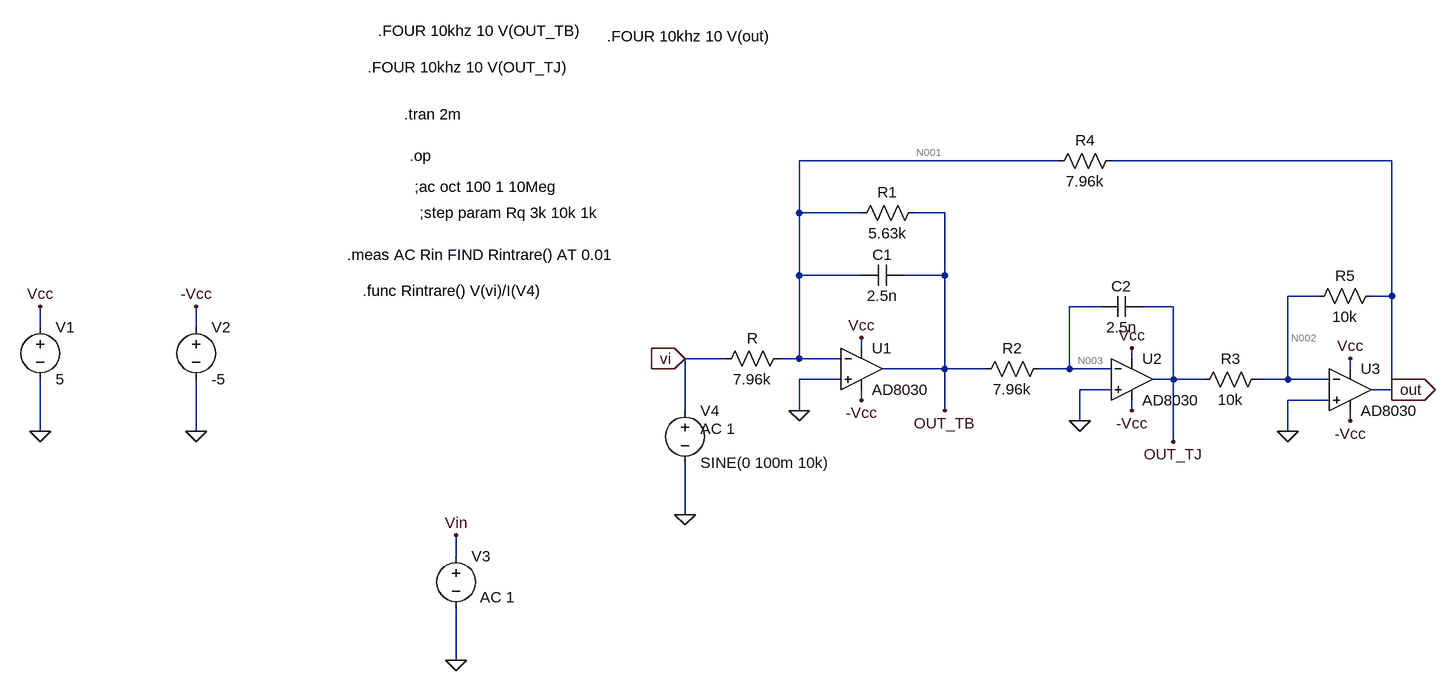
[diagram p0: schematic etaj2_.asc]
etaj2_.asc, the LTspice schematic file:
Version 4
SHEET 1 880 712
WIRE 208 -528 -192 -528
WIRE 720 -528 288 -528
WIRE -192 -448 -192 -528
WIRE -96 -448 -192 -448
WIRE 32 -448 -16 -448
WIRE -192 -352 -192 -448
WIRE -96 -352 -192 -352
WIRE 32 -352 32 -448
WIRE 32 -352 -32 -352
WIRE 608 -320 560 -320
WIRE 720 -320 720 -528
WIRE 720 -320 688 -320
WIRE 272 -304 224 -304
WIRE 384 -304 336 -304
WIRE -1360 -272 -1360 -304
WIRE -1120 -272 -1120 -304
WIRE -96 -240 -96 -256
WIRE -304 -224 -368 -224
WIRE -192 -224 -192 -352
WIRE -192 -224 -224 -224
WIRE -128 -224 -192 -224
WIRE 320 -224 320 -240
WIRE 32 -208 32 -352
WIRE 32 -208 -64 -208
WIRE 96 -208 32 -208
WIRE 224 -208 224 -304
WIRE 224 -208 176 -208
WIRE 288 -208 224 -208
WIRE 656 -208 656 -224
WIRE -128 -192 -192 -192
WIRE 384 -192 384 -304
WIRE 384 -192 352 -192
WIRE 432 -192 384 -192
WIRE 560 -192 560 -320
WIRE 560 -192 512 -192
WIRE 624 -192 560 -192
WIRE 288 -176 240 -176
WIRE 720 -176 720 -320
WIRE 720 -176 688 -176
WIRE -96 -160 -96 -176
WIRE 624 -160 560 -160
WIRE -368 -144 -368 -224
WIRE -192 -144 -192 -192
WIRE 32 -144 32 -208
WIRE 320 -144 320 -160
WIRE 240 -128 240 -176
WIRE 656 -128 656 -144
WIRE -1360 -112 -1360 -192
WIRE -1120 -112 -1120 -192
WIRE 560 -112 560 -160
WIRE 384 -96 384 -192
WIRE -368 16 -368 -64
WIRE -720 80 -720 48
WIRE -720 240 -720 160
FLAG -192 -144 0
FLAG 240 -128 0
FLAG 560 -112 0
FLAG -96 -256 Vcc
FLAG 320 -240 Vcc
FLAG 656 -224 Vcc
FLAG -96 -160 -Vcc
FLAG 320 -144 -Vcc
FLAG 656 -128 -Vcc
FLAG -720 48 Vin
FLAG 32 -144 OUT_TB
FLAG 384 -96 OUT_TJ
FLAG -1360 -304 Vcc
FLAG -1120 -304 -Vcc
FLAG -1360 -112 0
FLAG -1120 -112 0
FLAG 720 -176 out
IOPIN 720 -176 Out
FLAG -720 240 0
FLAG -368 16 0
FLAG -368 -224 vi
IOPIN -368 -224 In
SYMBOL OpAmps\\AD8030 -96 -272 R0
SYMATTR InstName U1
SYMBOL OpAmps\\AD8030 320 -256 R0
SYMATTR InstName U2
SYMBOL OpAmps\\AD8030 656 -240 R0
SYMATTR InstName U3
SYMBOL res -208 -240 R90
WINDOW 0 0 56 VBottom 2
WINDOW 3 32 56 VTop 2
SYMATTR InstName R
SYMATTR Value 7.96k
SYMBOL res 192 -224 R90
WINDOW 0 0 56 VBottom 2
WINDOW 3 32 56 VTop 2
SYMATTR InstName R2
SYMATTR Value 7.96k
SYMBOL res 528 -208 R90
WINDOW 0 0 56 VBottom 2
WINDOW 3 32 56 VTop 2
SYMATTR InstName R3
SYMATTR Value 10k
SYMBOL res 304 -544 R90
WINDOW 0 0 56 VBottom 2
WINDOW 3 32 56 VTop 2
SYMATTR InstName R4
SYMATTR Value 7.96k
SYMBOL res 0 -464 R90
WINDOW 0 0 56 VBottom 2
WINDOW 3 32 56 VTop 2
SYMATTR InstName R1
SYMATTR Value 5.63k
SYMBOL cap -96 -336 R270
WINDOW 0 32 32 VTop 2
WINDOW 3 0 32 VBottom 2
SYMATTR InstName C1
SYMATTR Value 2.5n
SYMBOL cap 272 -288 R270
WINDOW 0 32 32 VTop 2
WINDOW 3 0 32 VBottom 2
SYMATTR InstName C2
SYMATTR Value 2.5n
SYMBOL res 704 -336 R90
WINDOW 0 0 56 VBottom 2
WINDOW 3 32 56 VTop 2
SYMATTR InstName R5
SYMATTR Value 10k
SYMBOL voltage -1360 -288 R0
SYMATTR InstName V1
SYMATTR Value 5
SYMBOL voltage -1120 -288 R0
SYMATTR InstName V2
SYMATTR Value -5
SYMBOL voltage -720 64 R0
WINDOW 123 37 79 Left 2
WINDOW 39 0 0 Left 0
SYMATTR Value2 AC 1
SYMATTR InstName V3
SYMATTR Value ""
SYMBOL voltage -368 -160 R0
WINDOW 123 24 44 Left 2
WINDOW 39 0 0 Left 0
SYMATTR Value2 AC 1
SYMATTR InstName V4
SYMATTR Value SINE(0 100m 10k)
TEXT -792 -536 Left 2 !.op
TEXT -784 -488 Left 2 !;ac oct 100 1 10Meg
TEXT -776 -448 Left 2 !;step param Rq 3k 10k 1k
TEXT -800 -600 Left 2 !.tran 2m
TEXT -856 -672 Left 2 !.FOUR 10khz 10 V(OUT_TJ)
TEXT -840 -728 Left 2 !.FOUR 10khz 10 V(OUT_TB)
TEXT -488 -720 Left 2 !.FOUR 10khz 10 V(out)
TEXT -888 -384 Left 2 !.meas AC Rin FIND Rintrare() AT 0.01
TEXT -864 -328 Left 2 !.func Rintrare() V(vi)/I(V4)

The netlist it stands for:
* etaj2_.asc
XU1 0 N001 Vcc -Vcc OUT_TB AD8040  ; AD8030, pins In+ In- V+ V- OUT
XU2 0 N003 Vcc -Vcc OUT_TJ AD8040  ; AD8030, pins In+ In- V+ V- OUT
XU3 0 N002 Vcc -Vcc out AD8040  ; AD8030, pins In+ In- V+ V- OUT
R N001 vi 7.96k
R2 N003 OUT_TB 7.96k
R3 N002 OUT_TJ 10k
R4 out N001 7.96k
R1 OUT_TB N001 5.63k
C1 N001 OUT_TB 2.5n
C2 N003 OUT_TJ 2.5n
R5 out N002 10k
V1 Vcc 0 5
V2 -Vcc 0 -5
V3 Vin 0 AC 1
V4 vi 0 SINE(0 100m 10k) AC 1
.op
;ac oct 100 1 10Meg
;step param Rq 3k 10k 1k
.tran 2m
.FOUR 10khz 10 V(OUT_TJ)
.FOUR 10khz 10 V(OUT_TB)
.FOUR 10khz 10 V(out)
.meas AC Rin FIND Rintrare() AT 0.01
.func Rintrare() V(vi)/I(V4)
.lib ADI.lib
.backanno
.end

* Results of the author's LTspice run, read from the files saved beside the schematic
* Operating Point, zero values left out:
*   V(vcc) = 5 V
*   V(-vcc) = -5 V
*   V(n001) = 856.4 nV
*   V(out_tb) = -13.53 mV
*   V(n003) = 531.4 nV
*   V(out_tj) = -22.6 mV
*   V(n002) = -269.8 nV
*   V(out) = 5.602 mV
*   I(R5) = 560.3 nA
*   I(R1) = -2.404 µA
*   I(R4) = 703.7 nA
*   I(R3) = 2.26 µA
*   I(R2) = 1.7 µA
*   I(R) = 107.6 pA
*   I(V4) = 107.6 pA
*   I(V2) = 3.909 mA
*   I(V1) = -3.914 mA
*   Ix(u1:1) = -1.7 µA
*   Ix(u1:2) = -1.7 µA
*   Ix(u1:3) = 1.304 mA
*   Ix(u1:4) = -1.305 mA
*   Ix(u1:5) = 4.104 µA
*   Ix(u2:1) = -1.7 µA
*   Ix(u2:2) = -1.7 µA
*   Ix(u2:3) = 1.304 mA
*   Ix(u2:4) = -1.303 mA
*   Ix(u2:5) = 2.26 µA
*   Ix(u3:1) = -1.7 µA
*   Ix(u3:2) = -1.7 µA
*   Ix(u3:3) = 1.306 mA
*   Ix(u3:4) = -1.301 mA
*   Ix(u3:5) = -1.264 µA
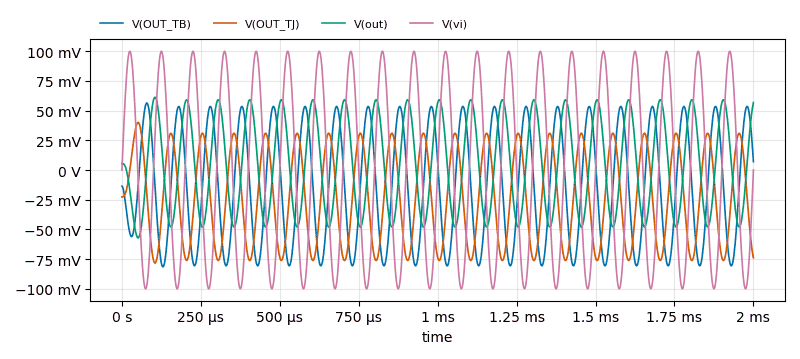
[diagram p1: Transient Analysis of etaj2_.asc, plotted from the saved traces]
* Transient Analysis, 1 run:
*   V(OUT_TB): min -81.5 mV, max 56.44 mV, average -13.02 mV, rms 48.94 mV, last 7.046 mV
*   V(OUT_TJ): min -78.21 mV, max 40.11 mV, average -21.68 mV, rms 43.68 mV, last -73.82 mV
*   V(out): min -57.1 mV, max 61.21 mV, average 4.678 mV, rms 38.2 mV, last 56.81 mV
*   V(vi): min -100 mV, max 100 mV, average 0 V, rms 70.71 mV, last 0 V
* From the log:
*   N-Period=1
*   Fourier components of V(out_tj)
*   DC component:-0.0226058
*   Harmonic  Frequency   Fourier   Normalized   Phase    Normalized
*    Number     [Hz]     Component   Component  [degree]  Phase [deg]
*       1     1.000e+04  5.353e-02  1.000e+00   -107.80°      0.00°
*       2     2.000e+04  4.422e-06  8.262e-05    -96.06°     11.74°
*       3     3.000e+04  5.571e-06  1.041e-04    -69.45°     38.35°
*       4     4.000e+04  6.775e-06  1.266e-04    -80.60°     27.20°
*       5     5.000e+04  5.441e-06  1.016e-04    -91.00°     16.80°
*       6     6.000e+04  4.301e-06  8.034e-05    -70.88°     36.92°
*       7     7.000e+04  5.856e-06  1.094e-04    -59.81°     47.99°
*       8     8.000e+04  6.264e-06  1.170e-04    -71.08°     36.72°
*       9     9.000e+04  4.807e-06  8.981e-05    -75.69°     32.11°
*      10     1.000e+05  4.380e-06  8.182e-05    -56.20°     51.60°
*   Total Harmonic Distortion: 0.030146%(0.076518%)
*   N-Period=1
*   Fourier components of V(out_tb)
*   DC component:-0.0135329
*   Harmonic  Frequency   Fourier   Normalized   Phase    Normalized
*    Number     [Hz]     Component   Component  [degree]  Phase [deg]
*       1     1.000e+04  6.702e-02  1.000e+00    162.21°      0.00°
*       2     2.000e+04  7.870e-06  1.174e-04     92.39°    -69.82°
*       3     3.000e+04  5.669e-06  8.459e-05     17.66°   -144.55°
*       4     4.000e+04  2.991e-06  4.463e-05   -111.64°   -273.85°
*       5     5.000e+04  6.959e-06  1.038e-04    153.19°     -9.01°
*       6     6.000e+04  6.875e-06  1.026e-04     91.69°    -70.52°
*       7     7.000e+04  4.169e-06  6.220e-05     14.25°   -147.96°
*       8     8.000e+04  2.735e-06  4.081e-05   -128.58°   -290.79°
*       9     9.000e+04  6.258e-06  9.337e-05    148.86°    -13.35°
*      10     1.000e+05  5.567e-06  8.306e-05     93.45°    -68.75°
*   Total Harmonic Distortion: 0.025572%(0.063720%)
*   N-Period=1
*   Fourier components of V(out)
*   DC component:0.00560522
*   Harmonic  Frequency   Fourier   Normalized   Phase    Normalized
*    Number     [Hz]     Component   Component  [degree]  Phase [deg]
*       1     1.000e+04  5.352e-02  1.000e+00     72.20°      0.00°
*       2     2.000e+04  4.423e-06  8.264e-05     83.93°     11.74°
*       3     3.000e+04  5.574e-06  1.041e-04    110.51°     38.31°
*       4     4.000e+04  6.775e-06  1.266e-04     99.40°     27.20°
*       5     5.000e+04  5.440e-06  1.016e-04     89.00°     16.81°
*       6     6.000e+04  4.299e-06  8.033e-05    109.12°     36.93°
*       7     7.000e+04  5.856e-06  1.094e-04    120.20°     48.01°
*       8     8.000e+04  6.264e-06  1.170e-04    108.93°     36.73°
*       9     9.000e+04  4.806e-06  8.980e-05    104.30°     32.11°
*      10     1.000e+05  4.378e-06  8.180e-05    123.80°     51.61°
*   Total Harmonic Distortion: 0.030149%(0.076518%)